# Altium project Interface_User_Board_01.PrjPcb
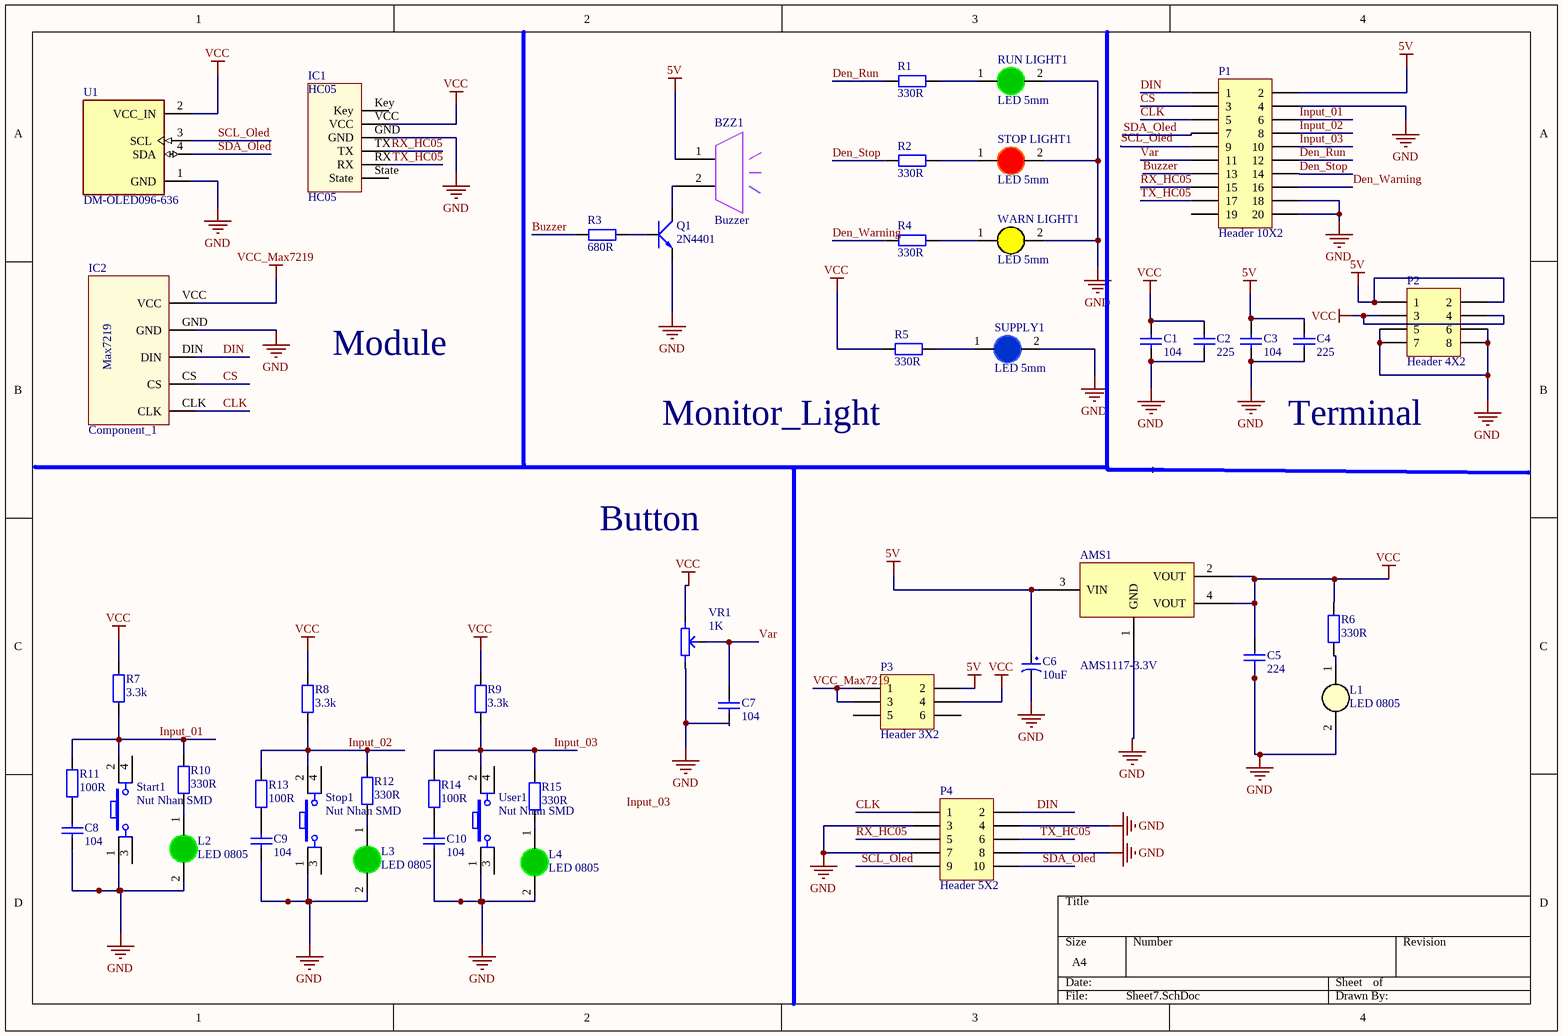
[diagram p0: Sheet7.SchDoc]
1 sheet, 47 parts. Net scope: global (net labels, ports and power ports of the same name join across sheets).
Board file: PCB6.PcbDoc

## Sheet Sheet7.SchDoc
size A4; SheetNumber: 1; SheetTotal: 1

### Parts
AMS1  AMS1117-3.3V  [SOT223]
BZZ1  Buzzer  [BUZZER_CT-1205-SMT]
C1  104  [tu 0805]
C2  225  [tu 0805]
C3  104  [tu 0805]
C4  225  [tu 0805]
C5  224  [tu 0805]
C6  10uF  [tu hoa 4mm]
C7  104  [tu 0805]
C8  104  [tu 0805]
C9  104  [tu 0805]
C10  104  [tu 0805]
IC1  HC05  [HC05]
IC2  Component_1  [PCBComponent_1]
L1  LED 0805  [LED-0805-Yellow]
L2  LED 0805  [LED-0805-Green]
L3  LED 0805  [LED-0805-Green]
L4  LED 0805  [LED-0805-Green]
P1  Header 10X2  [HDR2X10]
P2  Header 4X2  [HDR2X4]
P3  Header 3X2  [HDR2X3]
P4  Header 5X2  [HDR2X5]
Q1  2N4401  [TO92]
R1  330R  [Tro SMD 0805]
R2  330R  [Tro SMD 0805]
R3  680R  [tro smd 0805]
R4  330R  [Tro SMD 0805]
R5  330R  [Tro SMD 0805]
R6  330R  [Tro SMD 0805]
R7  3.3k  [tro smd 0805]
R8  3.3k  [tro smd 0805]
R9  3.3k  [tro smd 0805]
R10  330R  [Tro SMD 0805]
R11  100R  [tro smd 0805]
R12  330R  [Tro SMD 0805]
R13  100R  [tro smd 0805]
R14  100R  [tro smd 0805]
R15  330R  [Tro SMD 0805]
RUN_LIGHT1  LED 5mm  [LED-5MM-Green]
Start1  Nut Nhan SMD  [Nut Nhan 4 Chan SMD 6x6]
Stop1  Nut Nhan SMD  [Nut Nhan 4 Chan SMD 6x6]
STOP_LIGHT1  LED 5mm  [LED-5MM-RED]
SUPPLY1  LED 5mm  [LED-5MM-BLUE]
U1  DM-OLED096-636  [MODULE_DM-OLED096-636]
User1  Nut Nhan SMD  [Nut Nhan 4 Chan SMD 6x6]
VR1  1K  [Bien Tro Tam Giac Dung]
WARN_LIGHT1  LED 5mm  [LED-5MM-Yellow]

### Nets
5V: AMS1.3(VIN) BZZ1.1 C3.1 C4.1 C6.1 P1.2 P2.1 P2.2 P3.2
GND: AMS1.1(GND) C1.2 C2.2 C3.2 C4.2 C5.2 C6.2 C7.2 C8.2 C9.2 C10.2 IC1.GND IC2.GND L1.2(K) L2.2(K) L3.2(K) L4.2(K) P1.4 P1.18 P1.20 P2.5 P2.6 P2.7 P2.8 P4.3 P4.4 P4.7 P4.8 Q1.1(E) RUN_LIGHT1.2(K) Start1.1 Stop1.1 STOP_LIGHT1.2(K) SUPPLY1.2(K) U1.1(GND) User1.1 VR1.3 WARN_LIGHT1.2(K)
VCC: AMS1.2(VOUT) AMS1.4(VOUT) C1.1 C2.1 C5.1 IC1.VCC P2.3 P2.4 P3.4 R5.1 R6.2 R7.2 R8.2 R9.2 U1.2(VCC_IN) VR1.1
VCC_Max7219: IC2.VCC P3.1 P3.3
Buzzer: P1.13 R3.1
CLK: IC2.CLK P1.5 P4.1
CS: IC2.CS P1.3
Den_Run: P1.12 R1.1
Den_Stop: P1.14 R2.1
Den_Warning: P1.16 R4.1
DIN: IC2.DIN P1.1 P4.2
Input_01: P1.6 R7.1 R10.1 R11.2 Start1.2
Input_02: P1.8 R8.1 R12.1 R13.2 Stop1.2
Input_03: P1.10 R9.1 R14.2 R15.1 User1.2
RX_HC05: IC1.TX P1.15 P4.5
SCL_Oled: P1.9 P4.9 U1.3(SCL)
SDA_Oled: P1.7 P4.10 U1.4(SDA)
TX_HC05: IC1.RX P1.17 P4.6
Var: C7.1 P1.11 VR1.2
NetBZZ1_2: BZZ1.2 Q1.2(C)
NetC8_1: C8.1 R11.1
NetC9_1: C9.1 R13.1
NetC10_1: C10.1 R14.1
NetL1_1: L1.1(A) R6.1
NetL2_1: L2.1(A) R10.2
NetL3_1: L3.1(A) R12.2
NetL4_1: L4.1(A) R15.2
NetQ1_3: Q1.3(B) R3.2
NetR1_2: R1.2 RUN_LIGHT1.1(A)
NetR2_2: R2.2 STOP_LIGHT1.1(A)
NetR4_2: R4.2 WARN_LIGHT1.1(A)
NetR5_2: R5.2 SUPPLY1.1(A)

Not connected (* = marked no-connect by the designer): IC1 Key State; P1 19; P3 5 6; Start1 3 4; Stop1 3 4; User1 3 4

### Notes on the sheet
- Module
- (near R5) Monitor_Light
- Terminal
- Button
- Labels drawn without touching a wire or pin: Input_03
- (in symbol Component_1) Max7219

### Library data of the parts
AMS1 = AMS1117 SMD: Dán; Value: AMS1117-3.3V SOT223; Don_Vi: Con; Ma_Hang: MH000596; Ghi_Chu: *; Kieu_Chan: *; Chung_Loai: Dán
C1 C3 C7-C10 = Tu 0805 104 50V 10%: Dán; Don_Vi: Con; So_Chan: 2; Ten_Linh_Kien: Tụ 0805 104-100nF 10% 50V; Ma_Hang: MH004551; Chung_Loai: Dán; Kieu_Chan: *
C2 C4 = Tu 0805 225 25V 10%: Dán; Don_Vi: Con; So_Chan: 2; Ten_Linh_Kien: Tụ 0805 225-2.2uF 25V 10%; Ma_Hang: MH007483; Chung_Loai: Dán; Kieu_Chan: *
C5 = Tu 0805 224 50V 10%: Dán; Don_Vi: Con; So_Chan: 2; Ten_Linh_Kien: Tụ 0805 224-0.22uF 10% 50V; Ma_Hang: MH004559; Chung_Loai: Dán; Kieu_Chan: *
C6 = Tu Hoa 10uF 25V 4x7: Cắm; So_Chan: 2; Ten_Linh_Kien: Tụ Hóa 10uF 25V 4x7MM; Don_Vi: Con; Ma_Hang: MH001349; Chung_Loai: Cắm; Kieu_Chan: *
IC1 = HC05: pin to pad: GND>3 Key>1 RX>5 State>6 TX>4 VCC>2
IC2 = Component_1: Max 7219 7 segment
L1 = LED 0805 Trang: Dán; Don_Vi: Con; Ma_Hang: MH002946; Ten_Linh_Kien: LED 0805 Màu Trắng ( White); Ghi_Chu: *; Kieu_Chan: *; Chung_Loai: Dán
L2-L4 = LED 0805 Xanh La: Dán; Don_Vi: Con; Ma_Hang: MH002326; Ten_Linh_Kien: LED 0805 Màu Xanh Lá (Green); Ghi_Chu: *; Kieu_Chan: *; Chung_Loai: Dán
P1 = Header 10X2: Header, 10-Pin, Dual row; LatestRevisionDate: 17-Jul-2002; LatestRevisionNote: Re-released for DXP Platform.; Publisher: Altium Limited
P2 = Header 4X2: Header, 4-Pin, Dual row; LatestRevisionDate: 17-Jul-2002; LatestRevisionNote: Re-released for DXP Platform.; Publisher: Altium Limited
P3 = Header 3X2: Header, 3-Pin, Dual row; LatestRevisionDate: 17-Jul-2002; LatestRevisionNote: Re-released for DXP Platform.; Publisher: Altium Limited
P4 = Header 5X2: Header, 5-Pin, Dual row; LatestRevisionDate: 17-Jul-2002; LatestRevisionNote: Re-released for DXP Platform.; Publisher: Altium Limited
Q1 = Trans C1815 DIP: NPN transistor; Value: C9014
R1 R2 R4-R6 R10 R12 R15 = Tro 0805 5% 330R: Dán; Don_Vi: Con; So_Chan: 2; Ten_Linh_Kien: Trở 0805 5% 330R; Ma_Hang: MH005337; Chung_Loai: Dán; Kieu_Chan: *
R3 = Tro 0805 1% 680R: Dán; Don_Vi: Con; So_Chan: 2; Ten_Linh_Kien: Trở 0805 1% 680R; Ma_Hang: MH005487; Chung_Loai: Dán; Kieu_Chan: *
R7-R9 = Tro 0805 5% 3.3k: Dán; Don_Vi: Con; So_Chan: 2; Ten_Linh_Kien: Trở 0805 5% 3.3k; Ma_Hang: MH005305; Chung_Loai: Dán; Kieu_Chan: *
R11 R13 R14 = Tro 0805 5% 100R: Dán; Don_Vi: Con; So_Chan: 2; Ten_Linh_Kien: Trở 0805 5% 100R; Ma_Hang: MH005251; Chung_Loai: Dán; Kieu_Chan: *
RUN_LIGHT1 = LED 5mm Xanh La: Cắm; Don_Vi: Con; Ma_Hang: MH008969; Ten_Linh_Kien: LED 5MM Phủ Xanh (1000c); Ghi_Chu: *; Kieu_Chan: *; Chung_Loai: Cắm
Start1 Stop1 User1 = Nut Nhan 4 Chan SMD 6x6: Nut Nhan 4 Chan 6.2x6.2x3.5; Ten: Nút Nhấn 4 Chân 6.2x6.2x3.1MM SMD; Ma_Hang: MH002424
STOP_LIGHT1 = LED 5mm Do: Cắm; Don_Vi: Con; Ma_Hang: MH008967; Ten_Linh_Kien: Led 5MM Phủ Đỏ (1000c); Ghi_Chu: *; Kieu_Chan: *; Chung_Loai: Cắm
SUPPLY1 = LED 5mm Xanh Duong: Cắm; Don_Vi: Con; Ma_Hang: MH008987; Ten_Linh_Kien: Led 5MM Xanh Dương Đục (1000c); Ghi_Chu: *; Kieu_Chan: *; Chung_Loai: Cắm
U1 = DM-OLED096-636: 0.96â€ 128 X 64 MONOCHROME GRAPHIC OLED DISPLAY MODULE - I2C; SnapEDA_Link: https://www.snapeda.com/parts/DM-OLED096-636/Display+Module/view-part/?ref=snap; Package: Package; Value: *; MF: Display Module; MP: DM-OLED096-636; Check_prices: https://www.snapeda.com/parts/DM-OLED096-636/Display+Module/view-part/?ref=eda
VR1 = Bien tro tam giac 1K Dung: Cắm; Ten_Linh_Kien: Biến Trở Tam Giác 102-1K RM065; Don_Vi: Con; Ma_Hang: MH003709; Ghi_Chu: *; Kieu_Chan: *; Chung_Loai: Cắm
WARN_LIGHT1 = LED 5mm Vang: Cắm; Don_Vi: Con; Ma_Hang: MH008968; Ten_Linh_Kien: Led 5MM Phủ Vàng (1000c); Ghi_Chu: *; Kieu_Chan: *; Chung_Loai: Cắm